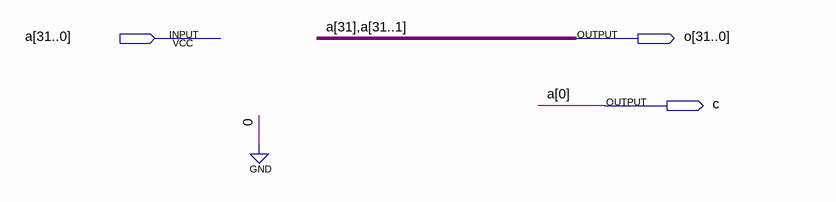
[diagram p0: schematic sheet]
// Quartus schematic AR_SR32.bdf as structural Verilog: 0 symbols, 3 pins
module AR_SR32 (
  input  [31:0] a,
  output [31:0] o,
  output c
);


  assign c = a[0];
  assign o = {{2{a[31]}}, a[30:1]};
endmodule
